# EAGLE design Orone-mini-S8C-v0r001 (EAGLE 5.11)
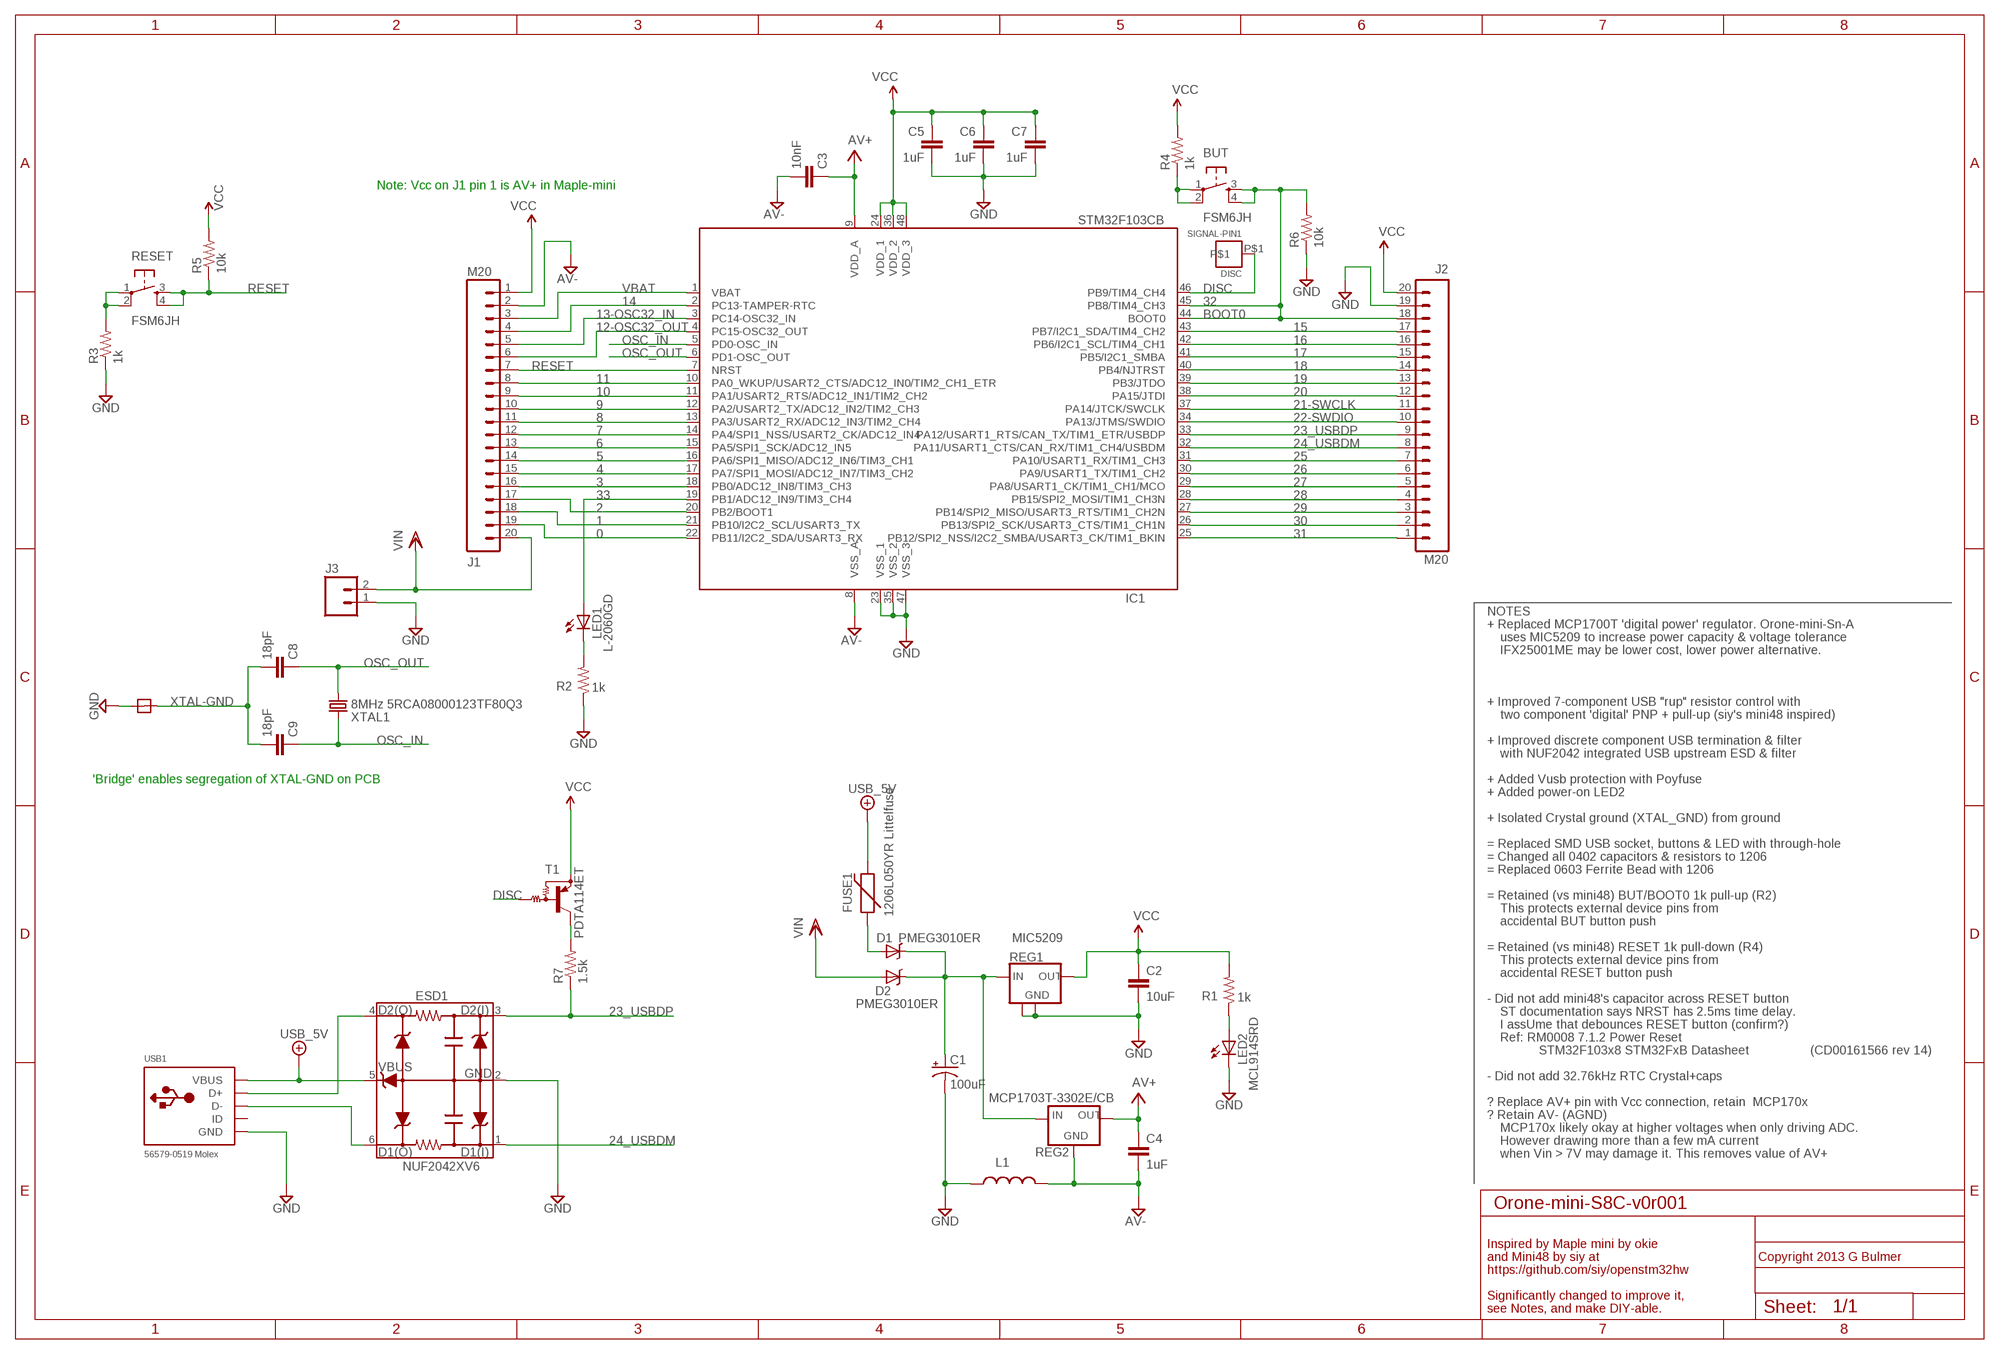
[diagram p0: schematic, sheet 1]

## Parts
BUT  FSM6JH  TAC_SWITCHPTH  [TACTILE-PTH]
C1  100uF  CAP_POL7343  [EIA7343]
C2  10uF  CAP1206  [1206]
C3  10nF  CAP1206  [1206]
C4  1uF  CAP1206  [1206]
C5  1uF  CAP1206  [1206]
C6  1uF  CAP1206  [1206]
C7  1uF  CAP1206  [1206]
C8  18pF  CAP1206  [1206]
C9  18pF  CAP1206  [1206]
D1  PMEG3010ER  DIODE-SCHOTTKYSOD-123W  [SOD-123W]
D2  PMEG3010ER  DIODE-SCHOTTKYSOD-123W  [SOD-123W]
DISC  SIGNAL-PIN1  [1PIN]
ESD1  NUF2042XV6  NUF2042XV6SOT563  [SOT563]
FUSE1  1206L050YR Littelfuse  PTCSMD  [PTC-1206]
IC1  STM32F103CB  [LQFP48]
J1  M20  [1X20]
J2  M20  [1X20]
J3  M02POLAR  [MOLEX-1X2]
L1  INDUCTOR1206  [1206]
LED1  L-2060GD  LED1.8MM-W  [LED1.8MM-W]
LED2  MCL914SRD  LED1.8MM-W  [LED1.8MM-W]
R1  1k  RESISTOR1206  [1206]
R2  1k  RESISTOR1206  [1206]
R3  1k  RESISTOR1206  [1206]
R4  1k  RESISTOR1206  [1206]
R5  10k  RESISTOR1206  [1206]
R6  10k  RESISTOR1206  [1206]
R7  1.5k  RESISTOR1206  [1206]
REG1  MIC5209  V_REG_LM2937SOT223-NT  [SOT223-NT]
REG2  MCP1703T-3302E/CB  MCP170XSOT23  [SOT23]
RESET  FSM6JH  TAC_SWITCHPTH  [TACTILE-PTH]
T1  PDTA114ET  ES_PNP-DRIVERSOT23-3  [ES_SOT23-3]
U$4  2PIN-GND-BRIDGE08X08MILS  [2PIN-08X08]
USB1  56579-0519 Molex  USB-MINIBTH-ODRILL  [USB-MINI-AB-TH-MOLEX-OVERDRILL]
XTAL1  8MHz 5RCA08000123TF80Q3  CRYSTAL5X3  [CRYSTAL-SMD-5X3]

## Nets
0: IC1.22(PB11/I2C2_SDA/USART3_RX) J1.19
1: IC1.21(PB10/I2C2_SCL/USART3_TX) J1.18
2: IC1.20(PB2/BOOT1) J1.17
3: IC1.18(PB0/ADC12_IN8/TIM3_CH3) J1.16
4: IC1.17(PA7/SPI1_MOSI/ADC12_IN7/TIM3_CH2) J1.15
5: IC1.16(PA6/SPI1_MISO/ADC12_IN6/TIM3_CH1) J1.14
6: IC1.15(PA5/SPI1_SCK/ADC12_IN5) J1.13
7: IC1.14(PA4/SPI1_NSS/USART2_CK/ADC12_IN4) J1.12
8: IC1.13(PA3/USART2_RX/ADC12_IN3/TIM2_CH4) J1.11
9: IC1.12(PA2/USART2_TX/ADC12_IN2/TIM2_CH3) J1.10
10: IC1.11(PA1/USART2_RTS/ADC12_IN1/TIM2_CH2) J1.9
11: IC1.10(PA0_WKUP/USART2_CTS/ADC12_IN0/TIM2_CH1_ETR) J1.8
12-OSC32_OUT: IC1.4(PC15-OSC32_OUT) J1.6
13-OSC32_IN: IC1.3(PC14-OSC32_IN) J1.5
14: IC1.2(PC13-TAMPER-RTC) J1.4
15: IC1.43(PB7/I2C1_SDA/TIM4_CH2) J2.17
16: IC1.42(PB6/I2C1_SCL/TIM4_CH1) J2.16
17: IC1.41(PB5/I2C1_SMBA) J2.15
18: IC1.40(PB4/NJTRST) J2.14
19: IC1.39(PB3/JTDO) J2.13
20: IC1.38(PA15/JTDI) J2.12
21-SWCLK: IC1.37(PA14/JTCK/SWCLK) J2.11
22-SWDIO: IC1.34(PA13/JTMS/SWDIO) J2.10
23_USBDP: ESD1.3(D2(I)) IC1.33(PA12/USART1_RTS/CAN_TX/TIM1_ETR/USBDP) J2.9 R7.1
24_USBDM: ESD1.1(D1(I)) IC1.32(PA11/USART1_CTS/CAN_RX/TIM1_CH4/USBDM) J2.8
25: IC1.31(PA10/USART1_RX/TIM1_CH3) J2.7
26: IC1.30(PA9/USART1_TX/TIM1_CH2) J2.6
27: IC1.29(PA8/USART1_CK/TIM1_CH1/MCO) J2.5
28: IC1.28(PB15/SPI2_MOSI/TIM1_CH3N) J2.4
29: IC1.27(PB14/SPI2_MISO/USART3_RTS/TIM1_CH2N) J2.3
30: IC1.26(PB13/SPI2_SCK/USART3_CTS/TIM1_CH1N) J2.2
31: IC1.25(PB12/SPI2_NSS/I2C2_SMBA/USART3_CK/TIM1_BKIN) J2.1
32: BUT.3 BUT.4 IC1.44(BOOT0) IC1.45(PB8/TIM4_CH3) J2.18 R6.2
33: IC1.19(PB1/ADC12_IN9/TIM3_CH4) LED1.A
+5V/2: ESD1.5(VBUS) FUSE1.2 USB1.VBUS ; supply symbol labelled USB_5V
AV+: C3.1 C4.1 IC1.9(VDD_A) REG2.2(OUT)
AV-: C3.2 C4.2 IC1.8(VSS_A) J1.2 L1.2 REG2.1(GND)
DGND: C1.C(-) C2.2 C5.2 C6.2 C7.2 ESD1.2(GND) IC1.23(VSS_1) IC1.35(VSS_2) IC1.47(VSS_3) J2.19 J3.1 L1.1 LED2.C R2.1 R3.1 R6.1 REG1.2(GND) REG1.4(GND) U$4.P$1 USB1.GND ; supply symbol labelled GND
DISC: DISC.P$1 IC1.46(PB9/TIM4_CH4) T1.1(B)
N$1: BUT.1 BUT.2 R4.1
N$2: LED1.C R2.2
N$3: D1.P$2.ANODE(A) FUSE1.1
N$4: R3.2 RESET.1 RESET.2
N$5: C1.A(+) D1.P$1.CATHODE(C) D2.P$1.CATHODE(C) REG1.1(IN) REG2.3(IN)
N$6: LED2.A R1.1
N$51: R7.2 T1.3(C)
N$59: ESD1.4(D2(O)) USB1.D+
N$60: ESD1.6(D1(O)) USB1.D-
OSC_IN: C9.1 IC1.5(PD0-OSC_IN) XTAL1.3
OSC_OUT: C8.1 IC1.6(PD1-OSC_OUT) XTAL1.1
RESET: IC1.7(NRST) J1.7 R5.1 RESET.3 RESET.4
VBAT: IC1.1(VBAT) J1.3
VCC: C2.1 C5.1 C6.1 C7.1 IC1.24(VDD_1) IC1.36(VDD_2) IC1.48(VDD_3) J1.1 J2.20 R1.2 R4.2 R5.2 REG1.3(OUT) T1.2(E)
VIN: D2.P$2.ANODE(A) J1.20 J3.2
XTAL-GND: C8.2 C9.2 U$4.P$2
Unconnected: USB1.ID

## Notes on the sheet
- Note: Vcc on J1 pin 1 is AV+ in Maple-mini
- BOOT0
- NOTES
- + Replaced MCP1700T 'digital power' regulator. Orone-mini-Sn-A
- uses MIC5209 to increase power capacity & voltage tolerance
- IFX25001ME may be lower cost, lower power alternative.
- + Improved 7-component USB "rup" resistor control with
- two component 'digital' PNP + pull-up (siy's mini48 inspired)
- + Improved discrete component USB termination & filter
- with NUF2042 integrated USB upstream ESD & filter
- 'Bridge' enables segregation of XTAL-GND on PCB | + Added Vusb protection with Poyfuse
- + Added power-on LED2
- + Isolated Crystal ground (XTAL_GND) from ground
- = Replaced SMD USB socket, buttons & LED with through-hole
- = Changed all 0402 capacitors & resistors to 1206
- = Replaced 0603 Ferrite Bead with 1206
- = Retained (vs mini48) BUT/BOOT0 1k pull-up (R2)
- This protects external device pins from
- accidental BUT button push
- = Retained (vs mini48) RESET 1k pull-down (R4)
- This protects external device pins from
- accidental RESET button push
- - Did not add mini48's capacitor across RESET button
- ST documentation says NRST has 2.5ms time delay.
- I assUme that debounces RESET button (confirm?)
- Ref: RM0008 7.1.2 Power Reset
- STM32F103x8 STM32FxB Datasheet | (CD00161566 rev 14)
- - Did not add 32.76kHz RTC Crystal+caps
- ? Replace AV+ pin with Vcc connection, retain  MCP170x
- ? Retain AV- (AGND)
- MCP170x likely okay at higher voltages when only driving ADC.
- However drawing more than a few mA current
- when Vin > 7V may damage it. This removes value of AV+
- Inspired by Maple mini by okie
- and Mini48 by siy at | Copyright 2013 G Bulmer
- https://github.com/siy/openstm32hw
- Significantly changed to improve it,
- see Notes, and make DIY-able.

## Library data of the parts
BUT RESET = SparkFun:TAC_SWITCH: Momentary Switch Button commonly used for reset or general input. Spark Fun Electronics SKU : COM-00097
C1 = smd-poly-cap:CAP_POL: Capacitor Polarized These are standard SMD and PTH capacitors. Normally 10uF, 47uF, and 100uF in electrolytic and tantalum varieties. Always verify the external diameter of the through hole cap, it varies with capacity, voltage, and manufacturer. The EIA devices should be standard.
C2-C9 = SMD-passives-gb01:CAP: Capacitor Standard 1206 SMD ceramic capacitor
D1 D2 = diode-schottky:DIODE-SCHOTTKY
DISC = signal-pins:SIGNAL-PIN1
ESD1 = USB-ESD-protection:NUF2042XV6: NUF2042XV6 - USB ESD protection, and Full-speed USB termination. Resistor values are 22ohm. Capacitor values are 42pF.
FUSE1 = SparkFun:PTC: Resettable Fuse PTC Resettable Fuse. Spark Fun Electronics SKU : COM-08357
IC1 = stm32:STM32F103CB
J1 J2 = SparkFun:M20: 20 pin Header Contains both standard and LOCK variants. The lock_special holes are staggared by 5 mil, like the lock variant, except for the last two holes. They are not altered from the "standard" footprint layout. This is used for a special purpose on the layout of our Graphic LCD Backpack. Make sure you want to use this device before selecting it for you project!
J3 = SparkFun:M02: Header 2 Standard 2-pin 0.1" header. Use with straight break away headers (SKU : PRT-00116), right angle break away headers (PRT-00553), swiss pins (PRT-00743), machine pins (PRT-00117), and female headers (PRT-00115). Molex polarized connector foot print use with SKU : PRT-08233 with associated crimp pins and housings.
L1 = SMD-passives-gb01:INDUCTOR: Inductors This is Sparkfun's Inductor, using the standard resistor/capacitor footprint. It has not been proven. The 1206 footprint also matches the Ferrite Bead footprint for fair-rite at fair-rite.com was http://www.fair-rite.com/cgibin/catalog.pgm?THEAPPL=Suppression+Components&THEWHERE=Board+Component&THEPART=Chip+Beads#select:freq1
LED1 LED2 = LED:LED: LEDs Standard schematic elements and footprints for 5mm, 3mm, 1206, and 0603 sized LEDs. 5mm - Spark Fun Electronics SKU : COM-00529 (and others)
R1-R7 = SMD-passives-gb01:RESISTOR: Resistor Basic schematic elements and footprints for 0603, 1206, and PTH resistors.
REG1 = V_REG_LM2937:V_REG_LM2937: LM2937-footprint LDO Voltage regulator LM2937 500mA minimum 4.75V in 3.3V out: http://www.ti.com/product/lm2937-3.3 or http://www.ti.com/product/lm2937 MIC5209 500mA, 600mV@0.5A dropout voltage (max): http://www.micrel.com/_PDF/mic5209.pdf MIC39100 1A, 630mV@1A dropout voltage (max): http://www.micrel.com/_PDF/mic39100.pdf
REG2 = MCP170x:MCP170X: Microchip MCP170x voltage regulator MCP1702 http://ww1.microchip.com/downloads/en/DeviceDoc/22008E.pdf MCP1703 http://ww1.microchip.com/downloads/en/DeviceDoc/22049f.pdf
T1 = pnp_digital_transistor:ES_PNP-DRIVER
U$4 = senzate-2010-02:2PIN-GND-BRIDGE
USB1 = USB-Mini-Molex:USB-MINIB: USB Connectors USBMINIB Thru-hole Mini-AB Molex RA TH-SLOT is Molex part # 56579-0576 (gbulmer) - Untested Thru-hole Mini-AB Molex RA TH-DRILL is Molex part # 56579-0576 **CHECK WITH PCB Maker close-drilling of holes is okay (gbulmer) - Untested Thru-hole Mini-B RA MULTICOMP-TH is a Multicomp MC32599 from Farnell.com (gbulmer) - Untested
XTAL1 = SparkFun2:CRYSTAL: Crystals Various standard crystals. Proven footprints. Spark Fun Electronics SKU : COM-00534

## Net classes
1 vcc: width 0.254 mm

## Board
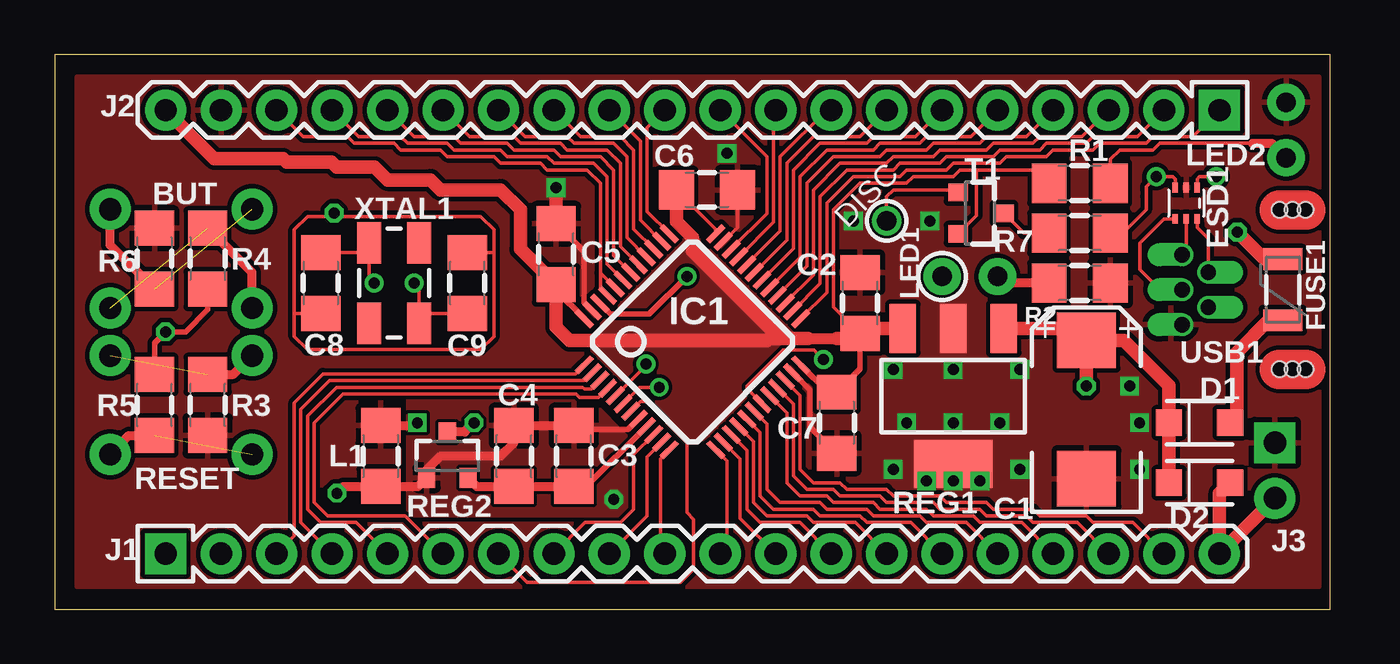
[diagram p1: board, top side]
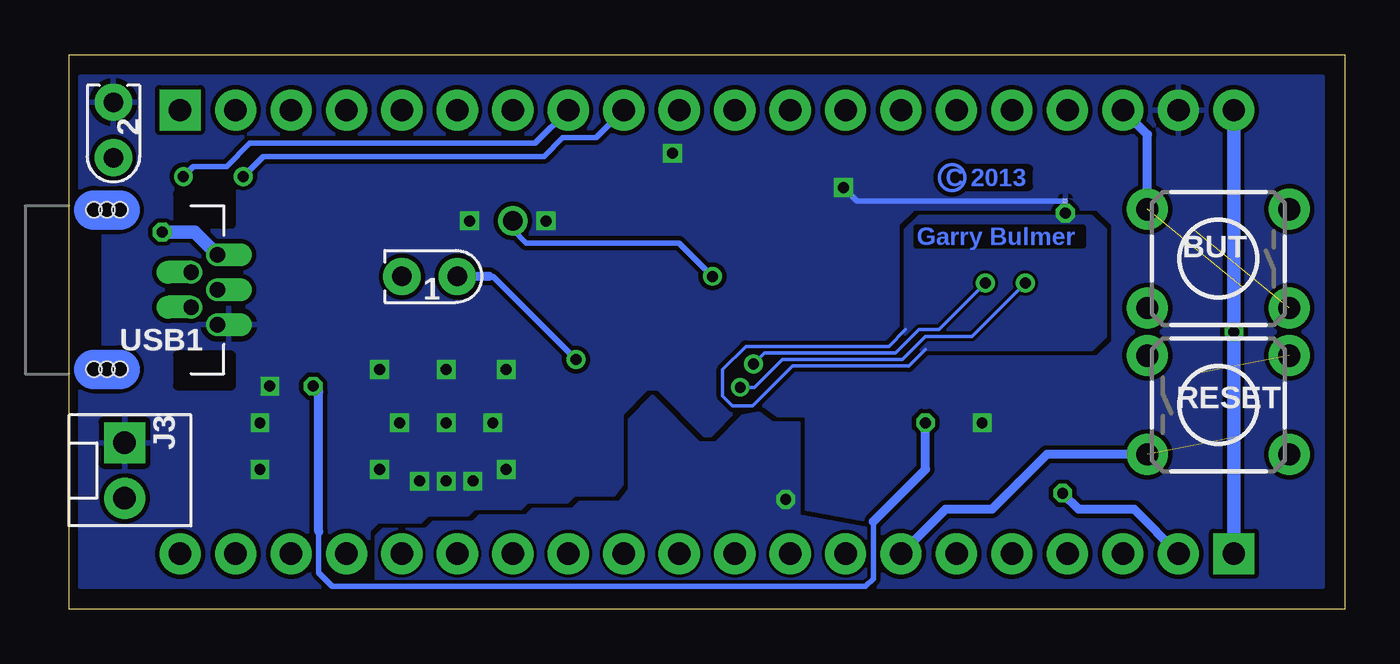
[diagram p2: board, bottom side, seen from below]

Size 58.42 x 25.4 mm. Coordinates in mm from the lower left corner, seen from the top.
Outline: 0,0 58.42,0 58.42,25.4 0,25.4 0,0
Copper layers (1*16): Top 0.0356mm / dielectric 1.5011mm / Bottom 0.0356mm
Design rules "LaenPCBOrder *": minimum track width 6mil, minimum drill 13mil, track to track 6mil, track to pad 6mil, pad to pad 6mil, via to via 6mil, smd to smd 6mil, copper to edge 15mil, drill to drill 6mil, minimum pad ring 7mil, minimum via ring 7mil, stop-mask expansion 4mil, vias tented up to drill 30mil, thermal gap 10mil
tRestrict: 1 lines

### Footprints (pad centres in the part's own frame; a part is rotated, then mirrored left to right if it is on the bottom)
TACTILE-PTH = drill 1.016 pad 1.88 round: 1 -3.251,2.261; 2 3.251,2.261; 3 -3.251,-2.261; 4 3.251,-2.261
EIA7343 = smd 2.55 x 2.7: A 3.17,0; C -3.17,0
1206 = smd 1.6 x 1.8: 1 -1.4,0; 2 1.4,0
SOD-123W = smd 1.2 x 1.2: P$1.CATHODE -1.4,0; P$2.ANODE 1.4,0
1PIN = drill 0.9 round: P$1 0,0
SOT563 = smd 0.25 x 0.45: 1 -0.5,-0.72; 2 0,-0.72; 3 0.5,-0.72; 4 0.5,0.72; 6 -0.5,0.72 | smd 0.25 x 0.44: 5 0,0.72
PTC-1206 = smd 1 x 1.8: 1 -1.4,0; 2 1.4,0
LQFP48@1 = smd 0.254 x 1: 1 -2.75,-4.25; 2 -2.25,-4.25; 3 -1.75,-4.25; 4 -1.25,-4.25; 5 -0.75,-4.25; 6 -0.25,-4.25; 7 0.25,-4.25; 8 0.75,-4.25; 9 1.25,-4.25; 10 1.75,-4.25; 11 2.25,-4.25; 12 2.75,-4.25; 25 2.75,4.25; 26 2.25,4.25; 27 1.75,4.25; 28 1.25,4.25; 29 0.75,4.25; 30 0.25,4.25; 31 -0.25,4.25; 32 -0.75,4.25; 33 -1.25,4.25; 34 -1.75,4.25; 35 -2.25,4.25; 36 -2.75,4.25 | smd 1 x 0.254: 13 4.25,-2.75; 14 4.25,-2.25; 15 4.25,-1.75; 16 4.25,-1.25; 17 4.25,-0.75; 18 4.25,-0.25; 19 4.25,0.25; 20 4.25,0.75; 21 4.25,1.25; 22 4.25,1.75; 23 4.25,2.25; 24 4.25,2.75; 37 -4.25,2.75; 38 -4.25,2.25; 39 -4.25,1.75; 40 -4.25,1.25; 41 -4.25,0.75; 42 -4.25,0.25; 43 -4.25,-0.25; 44 -4.25,-0.75; 45 -4.25,-1.25; 46 -4.25,-1.75; 47 -4.25,-2.25; 48 -4.25,-2.75
1X20 = drill 1.016 pad 1.88 square: 1 0,0 | drill 1.016 pad 1.88 round: 2 2.54,0; 3 5.08,0; 4 7.62,0; 5 10.16,0; 6 12.7,0; 7 15.24,0; 8 17.78,0; 9 20.32,0; 10 22.86,0; 11 25.4,0; 12 27.94,0; 13 30.48,0; 14 33.02,0; 15 35.56,0; 16 38.1,0; 17 40.64,0; 18 43.18,0; 19 45.72,0; 20 48.26,0
MOLEX-1X2 = drill 1.016 pad 1.88 square: 1 0,0 | drill 1.016 pad 1.88 round: 2 2.54,0
LED1.8MM-W = drill 0.9 pad 1.7 round: A 0,1.27; C 0,-1.27
SOT223-NT = smd 1.219 x 2.235: 1 -2.311,-3.099; 2 0,-3.099; 3 2.311,-3.099 | smd 3.6 x 2.2: 4 0,3.099
SOT23 = smd 0.8 x 0.9: 1 -0.95,-1; 2 0.95,-1; 3 0,1.1
ES_SOT23-3 = smd 0.8 x 0.9: 1 -0.95,-1; 2 0.95,-1; 3 0,1.1
2PIN-08X08 = smd 0.203 x 0.203: P$1 -0.102,0; P$2 0.102,0
USB-MINI-AB-TH-MOLEX-OVERDRILL = drill 0.7 offset: D+ 1.2,0; D- 0,0.8; GND 1.2,-1.6; ID 0,-0.8; VBUS 1.2,1.6 | hole 0.7: -4.45,3.65; -3.25,3.65; -4.45,-3.65; -3.25,-3.65; -3.85,3.65; -3.85,-3.65
CRYSTAL-SMD-5X3 = smd 1.9 x 1.1: 1 -1.85,-1.15; 2 1.85,-1.15; 3 1.85,1.15; 4 -1.85,1.15

### Placement (x,y rotation side)
BUT  5.79,16.05 180 bottom
C1  47.24,9.14 90 top
C2  36.88,14.02 90 top
C3  23.77,7.01 90 top
C4  21.03,7.01 90 top
C5  22.96,16.26 90 top
C6  29.87,19.2 0 top
C7  35.81,8.53 270 top
C8  12.19,14.94 270 top
C9  18.9,14.94 90 top
D1  52.43,8.53 0 top
D2  52.43,5.79 0 top
DISC  38.1,17.78 0 top
ESD1  51.82,18.59 180 top
FUSE1  56.24,14.63 90 top
IC1  STM32F103CB  [LQFP48@1]  29.21,12.24 315 top
J1  5.08,2.54 0 top
J2  53.34,22.86 180 top
J3  55.88,7.62 270 bottom
L1  14.94,7.01 270 top
LED1  41.91,15.24 270 bottom
LED2  56.39,21.95 180 bottom
R1  46.94,19.51 180 top
R2  46.94,14.94 180 top
R3  7.01,9.35 90 top
R4  7.01,16.05 270 top
R5  4.57,9.35 90 top
R6  4.57,16.05 270 top
R7  46.94,17.22 180 top
REG1  41.15,9.75 180 top
REG2  17.98,7.01 0 top
RESET  5.79,9.35 0 bottom
T1  42.37,18.14 270 top
U$4  12.8,18.59 270 bottom
USB1  52.83,14.63 0 bottom
XTAL1  15.54,14.94 270 top

### Tracks (layer width: path | path; a pad name or v marks a point on that pad's centre or on a via)
0
  Top 0.152: IC1.22 34.14,9.79 34.14,6.4 34.75,5.79 35.97,5.79 36.27,5.49 38.1,5.49 38.41,5.18 40.54,5.18 40.84,4.88 42.67,4.88 42.98,4.57 44.81,4.57 45.11,4.27 47.24,4.27 47.55,3.96 49.38,3.96 J1.19
1
  Top 0.152: IC1.21 33.83,9.39 33.83,6.1 34.44,5.49 35.66,5.49 35.97,5.18 37.8,5.18 38.1,4.88 40.23,4.88 40.54,4.57 42.37,4.57 42.67,4.27 44.5,4.27 44.81,3.96 46.84,3.96 J1.18
2
  Top 0.152: IC1.20 33.53,8.98 33.53,5.79 34.14,5.18 35.36,5.18 35.66,4.88 37.49,4.88 37.8,4.57 39.93,4.57 40.23,4.27 42.06,4.27 42.37,3.96 44.3,3.96 J1.17
3
  Top 0.152: IC1.18 32.61,8.49 32.61,5.49 33.22,4.88 35.05,4.88 35.36,4.57 37.19,4.57 37.49,4.27 39.62,4.27 39.93,3.96 41.76,3.96 J1.16
4
  Top 0.152: IC1.17 32.31,8.08 32.31,5.18 32.92,4.57 34.75,4.57 35.05,4.27 36.88,4.27 37.19,3.96 39.22,3.96 J1.15
5
  Top 0.152: IC1.16 32,7.68 32,4.88 32.61,4.27 34.44,4.27 34.75,3.96 36.68,3.96 J1.14
6
  Top 0.152: IC1.15 31.7,7.28 31.7,4.57 32.31,3.96 34.14,3.96 J1.13
7
  Top 0.152: IC1.14 31.39,6.88 31.39,4.17 J1.12
8
  Top 0.152: IC1.13 30.79,6.78 30.79,2.85 J1.11
9
  Top 0.152: IC1.12 27.74,6.88 27.74,2.74 J1.10
10
  Top 0.152: IC1.11 27.13,6.98 27.13,4.27 J1.9
11
  Top 0.152: IC1.10 26.52,7.08 26.52,4.57 25.91,3.96 24.28,3.96 J1.8
12-OSC32_OUT
  Top 0.152: IC1.4 24.9,9.7 24.03,9.7 23.88,9.86 13.21,9.86 11.89,8.53 11.89,4.88 12.5,4.27 16.05,4.27 J1.6
13-OSC32_IN
  Top 0.152: IC1.3 24.58,10.08 24.26,10.08 24.18,10.16 12.9,10.16 11.58,8.84 11.58,4.57 12.19,3.96 13.82,3.96 J1.5
14
  Top 0.152: IC1.2 24.25,10.46 12.6,10.46 11.28,9.14 11.28,3.96 J1.4
15
  Top 0.152: IC1.43 25.3,15.8 25.3,19.81 24.69,20.42 22.86,20.42 22.55,20.73 20.73,20.73 20.42,21.03 18.29,21.03 17.98,21.34 16.15,21.34 15.85,21.64 13.92,21.64 J2.17
16
  Top 0.152: IC1.42 25.6,16.2 25.6,20.12 24.99,20.73 23.16,20.73 22.86,21.03 21.03,21.03 20.73,21.34 18.59,21.34 18.29,21.64 16.46,21.64 J2.16
17
  Top 0.152: IC1.41 25.91,16.61 25.91,20.42 25.3,21.03 23.47,21.03 23.16,21.34 21.34,21.34 21.03,21.64 19,21.64 J2.15
18
  Top 0.152: IC1.40 26.21,17.01 26.21,20.73 25.6,21.34 23.77,21.34 23.47,21.64 21.54,21.64 J2.14
19
  Top 0.152: IC1.39 26.52,17.41 26.52,21.03 25.91,21.64 24.08,21.64 J2.13
20
  Top 0.152: IC1.38 26.82,17.81 26.82,21.44 J2.12
21-SWCLK
  Top 0.152: IC1.37 27.13,18.21 27.13,22.05 J2.11
22-SWDIO
  Top 0.152: IC1.34 32.61,18.12 32.61,20.73 J2.10
23_USBDP  (via drill 0.5)
  Top 0.152: IC1.33 32.92,17.72 32.92,22.76 J2.9 | R7.1 48.92,17.22 49.99,18.29 49.99,18.9 49.99,19.2 49.99,19.36 v50.44,19.81 51.21,19.81 51.32,19.7 ESD1.3
  Bottom 0.254: J2.9 34.29,21.59 35.81,21.59 36.68,20.73 49.53,20.73 v50.44,19.81
24_USBDM  (via drill 0.5)
  Top 0.152: IC1.32 33.22,17.32 33.22,20.73 35.36,22.86 J2.8 | ESD1.1 52.32,19.7 52.43,19.81 v53.19,19.81
  Bottom 0.254: J2.8 37.08,21.34 50.14,21.34 51.21,20.27 52.73,20.27 v53.19,19.81
25
  Top 0.152: IC1.31 33.53,16.91 33.53,20.42 34.75,21.64 36.88,21.64 J2.7
26
  Top 0.152: IC1.30 33.83,16.51 33.83,20.12 35.05,21.34 37.19,21.34 37.49,21.64 39.42,21.64 J2.6
27
  Top 0.152: IC1.29 34.14,16.11 34.14,19.81 35.36,21.03 37.49,21.03 37.8,21.34 39.62,21.34 39.93,21.64 41.96,21.64 J2.5
28
  Top 0.152: IC1.28 34.44,15.71 34.44,19.51 35.66,20.73 37.8,20.73 38.1,21.03 39.93,21.03 40.23,21.34 42.37,21.34 42.67,21.64 44.5,21.64 J2.4
29
  Top 0.152: IC1.27 34.75,15.3 34.75,19.2 35.97,20.42 38.1,20.42 38.41,20.73 40.23,20.73 40.54,21.03 42.67,21.03 42.98,21.34 44.81,21.34 45.11,21.64 47.04,21.64 J2.3
30
  Top 0.152: IC1.26 35.05,14.9 35.05,18.9 36.27,20.12 38.41,20.12 38.71,20.42 40.54,20.42 40.84,20.73 42.98,20.73 43.28,21.03 45.11,21.03 45.41,21.34 47.24,21.34 47.55,21.64 49.58,21.64 J2.2
31
  Top 0.152: IC1.25 35.36,14.5 35.36,18.59 36.58,19.81 38.71,19.81 39.01,20.12 40.84,20.12 41.15,20.42 43.28,20.42 43.59,20.73 45.41,20.73 45.72,21.03 47.55,21.03 47.85,21.34 49.99,21.34 50.29,21.64 52.12,21.64 J2.1
32  (1 unrouted)
  Top 0.152: 24.99,15.4 IC1.44 | 24.99,15.4 24.99,19.51 24.38,20.12 22.55,20.12 22.25,20.42 20.42,20.42 20.12,20.73 17.98,20.73 17.68,21.03 15.85,21.03 15.54,21.34 13.72,21.34 13.41,21.64 11.38,21.64 J2.18 | IC1.45 24.99,14.69 24.99,15.4
  Top 0.406: BUT.3 2.54,16.68 R6.2
  Bottom 0.406: J2.18 9.04,21.74 BUT.4
33  (via drill 0.5)
  Top 0.152: IC1.19 31.7,10.11 31.7,10.21 33.35,11.86 34.77,11.86 v35.2,11.43
  Bottom 0.254: v35.2,11.43 39.01,15.24 39.17,15.24
  Bottom 0.406: 39.17,15.24 LED1.A
+5V/2  (via drill 0.5)
  Top 0.152: ESD1.5 51.82,16.41 USB1.VBUS
  Top 0.61: v54.15,17.27 55.39,16.03 FUSE1.2
  Bottom 0.61: v54.15,17.27 52.67,17.27 USB1.VBUS
AV+
  Top 0.254: IC1.9 24.34,5.61 C3.1
  Top 0.406: C3.1 C4.1 19.33,5.61 REG2.2
AV-  (via drill 0.5)
  Top 0.254: IC1.8 26.26,8.23 23.95,8.23 C3.2
  Top 0.406: C3.2 C4.2 21.03,7.62 20.42,7.01 17.68,7.01 17.03,6.37 REG2.1 16.63,5.61 L1.2 13.23,5.61 v12.93,5.31
  Bottom 0.406: v12.93,5.31 12.19,4.57 9.65,4.57 J1.2
  other vias: 25.6,5.03
  pour Top: 16.15,9.75 24.38,9.75 26.52,7.62 26.52,4.27 16.15,4.27
  pour Bottom: 31.7,9.75 32.77,8.69 32.77,5.49 33.22,4.88 35.05,4.88 35.36,4.57 37.19,4.57 37.49,4.27 39.62,4.27 39.93,3.96 41.76,3.96 42.06,3.66 44.04,3.66 44.35,3.35 44.35,1.37 21.64,1.07 21.64,3.66 24.99,4.27 24.99,8.53 26.21,8.53 26.82,8.99 27.58,8.84 28.8,7.62 29.57,7.62
DGND  (via drill 0.5)
  Top 0.152: IC1.35 31.27,17.48 C6.2
  Top 0.254: IC1.47 24.23,14.04 24.23,16.39 C5.2 | IC1.23 34.59,10.04 34.59,8.35 C7.2
  Top 0.406: L1.1 16.49,8.41 v16.61,8.53
  Top 0.61: v22.96,19.3 C5.2
  Bottom 0.254: U$4.P$1 22.35,18.69 v22.96,19.3
  other vias: 30.78,20.88 38.4,6.4 44.2,6.4 38.4,10.97 39.01,8.53 41.15,8.53 43.28,8.53 44.2,10.97 41.15,10.97 41.15,5.87 49.68,8.53 49.23,10.21 40.08,17.78 49.68,6.4 42.37,5.87 39.93,5.87 36.58,17.78
  pour Bottom (isolate 0.203, rank 2): 1.02,1.02 57.91,1.02 57.91,24.38 1.02,24.38
  pour Top (isolate 0.203, rank 2): 1.02,1.02 57.91,1.02 57.91,24.38 1.02,24.38
DISC  (via drill 0.5)
  Top 0.152: T1.1 41.25,19.2 38.41,19.2 38.1,18.9 DISC.P$1
  Top 0.254: IC1.46 25.46,13.51 27.23,13.51 v28.96,15.24
  Bottom 0.254: v28.96,15.24 30.48,16.76 37.49,16.76 38.1,17.37 DISC.P$1
N$1  (1 unrouted)
  Top 0.406: BUT.2 9.04,15.42 R4.1
N$2
  Top 0.406: R2.2 43.48,14.94 LED1.C
N$3
  Top 0.61: D1.P$2.ANODE 54.13,8.84 54.13,11.76 55.6,13.23 FUSE1.1
N$4  (1 unrouted)
  Top 0.406: RESET.1 8.18,10.75 R3.2
N$5  (via drill 0.5)
  Top 0.406: REG2.3 18.78,8.11 v19.2,8.53
  Top 0.61: D2.P$1.CATHODE D1.P$1.CATHODE 51.03,10.24 48.95,12.31 C1.A | C1.A 46.71,12.85 REG1.1 | v47.24,10.21 C1.A
  Bottom 0.254: 21.59,4.01 21.59,1.4 21.95,1.04 46.38,1.04 46.99,1.65 46.99,3.56
  Bottom 0.406: v19.2,8.53 19.2,6.4 21.59,4.01 | 46.99,3.56 46.99,9.96 v47.24,10.21
N$6
  Top 0.152: R1.1 48.34,20.6 48.77,21.03 50.29,21.03 50.6,21.34 54.86,21.34
  Top 0.406: 54.86,21.34 55.73,21.34 LED2.A
N$51
  Top 0.152: T1.3 44.38,17.22 R7.2
N$59
  Top 0.152: USB1.D+ 50.6,14.63 49.68,15.54 49.68,16.76 50.79,17.87 ESD1.4
N$60
  Top 0.152: USB1.D- 52.83,16.97 52.32,17.48 ESD1.6
OSC_IN  (via drill 0.5)
  Top 0.152: IC1.5 27.08,11.17 v27.08,11.23 | v16.46,14.94 16.7,14.7 XTAL1.3 17.14,13.54 C9.1
  Bottom 0.152: v16.46,14.94 18.59,12.8 19.51,12.8 20.57,11.73 26.57,11.73 v27.08,11.23
OSC_OUT  (via drill 0.5)
  Top 0.152: IC1.6 26.77,10.16 v27.69,10.16 | v14.63,14.94 14.39,15.17 XTAL1.1 13.95,16.34 C8.1
  Bottom 0.152: v14.63,14.94 17.07,12.5 19.2,12.5 20.27,11.43 25.76,11.43 27.03,10.16 v27.69,10.16
RESET  (1 unrouted)
  Top 0.152: IC1.7 26.82,9.5 27.08,9.5 28.96,7.62 28.96,4.42 29.26,4.12 29.26,1.83 28.65,1.22 21.64,1.22 J1.7
  Top 0.406: R5.1 3.4,7.95 RESET.4
  Bottom 0.406: J1.7 18.29,4.57 16.15,4.57 13.64,7.09 RESET.3
VBAT
  Top 0.152: IC1.1 23.85,10.77 12.29,10.77 10.97,9.45 10.97,3.35 J1.3
VCC  (via drill 0.5)
  Top 0.152: J2.20 5.59,22.35 | IC1.36 30.27,17.4 C6.1 | 42.22,20.12 41.45,20.12 41.15,19.81 39.32,19.81 39.01,19.51 36.88,19.51 35.66,18.29 35.66,13.84 C2.1 | 42.22,20.12 44.93,20.12 R1.2 | T1.2 42.22,18.03 42.22,20.12
  Top 0.203: IC1.48 24.05,13.51
  Top 0.254: IC1.48 22.96,14.6 C5.1 | R5.2 4.57,12.19 v5.08,12.7 5.99,12.7 7.01,13.72 R4.2 | IC1.24 35.41,9.93 C7.1 36.88,11 C2.1
  Top 0.508: 34.44,12.39 34.49,12.39 35.81,12.39
  Top 0.61: J2.20 7.32,20.62 10.46,20.62 10.62,20.47 12.68,20.47 12.9,20.24 14.66,20.24 15.24,19.66 17.22,19.66 17.68,19.2 20.42,19.2 21.34,18.29 21.34,16.48 C5.1 22.96,12.92 23.59,12.29 32.61,12.29 32.72,12.39 33.22,12.39 | C6.1 28.47,17.76 29.21,17.02 29.21,16.41 33.22,12.39 | 33.22,12.39 34.49,12.39 | 35.81,12.39 36.66,12.39 C2.1 37.11,12.85 REG1.3
  Bottom 0.61: J1.1 v5.08,12.7 J2.20
  pour Top: 24.64,12.83 28.7,16.89 29.72,16.89 33.78,12.83 33.86,11.73 29.72,7.67 28.7,7.67 24.64,11.81
VIN
  Top 0.61: J3.2 J1.20 53.34,5.31 D2.P$2.ANODE
XTAL-GND  (via drill 0.5)
  Top 0.152: 10.97,13.54 10.97,12.5 11.58,11.89 19.51,11.89 20.12,12.5 20.12,16.34 | 10.97,13.54 C8.2 | 10.97,13.54 10.97,17.37 11.58,17.98 12.65,17.98 v12.8,18.14 12.95,17.98 19.51,17.98 20.12,17.37 20.12,16.34 | 20.12,16.34 C9.2
  Bottom 0.152: v12.8,18.14 U$4.P$2 | 19.2,11.89 19.96,11.12 25.3,11.12 27.13,9.3 28.04,9.3 28.5,9.75 28.5,10.97 27.43,12.04 20.88,12.04 20.12,12.8
  pour Bottom: 19.51,17.98 11.58,17.98 10.97,17.37 10.97,12.5 11.58,11.89 19.51,11.89 20.12,12.5 20.12,17.37
(copper drawn outside any net)
  shapes: Bottom circle x1

### Text on the board
Bottom: C 2013 | Garry Bulmer
tNames: BUT | USB1 | RESET | J3
bNames: 2 | 1
Document: Copyright 2013 G. Bulmer | 40pin 0.8" row spacing | This work is licensed under a | Creative Commons Attribution-ShareAlike 3.0 Unported License | I ask that my name remain visible in the copper | The pin headers are standard 'breadboard friendly' 0.1" pitch. | The two rows of pin headers are 0.8" apart, and hence fit a single breadboard. | The board is 2.3" long x 1" high. Most components are 1206 or larger. | Notes: | Change from 0805 to 1206 components is too much to fit in mini 2.1" length | Hence the board is lengthened from 2.1" to 2.3" | Replaced C1 with 7343-case size | Design Rules: OSHPark.com & Seeedstudio 'Fusion' PCB Service | Routing: | All Crystal tracks & Top Layer MCU tracks are 6mil/6mil | in order to make enough space for components and isolation. | All tracks from thru-hole (hand soldered) components, except pin headers, | are 10mil or wider. This is intended to make the tacks more robust. | All Bottom Layer tracks are 10mil or bigger, except Crystal tracks; | this is intended to be easier to make. | Copper pours have 10mil isolation; this is intended to be easier to make. | Vias: The three via shapes are used to give information, and help 'read' the PCB. | Vias Key: | SQUARE: Digital Ground (DGND) and thermal vias | ROUND: Signal | OCTAGON: Power (e.g. Vcc) or segregated Ground (e.g. AGND) | NOTE: There are four Hidden Airwires, which do not need routing (replicated on switches) | For safety, type 'RATSNEST *' to make them visible before making any changes
tDocu: Ground | Heatsink
_bsilk: but | 15 | 16 | 17 | 18 | 19 | 20 | 21 | 22 | 23 | 24 | 25 | 26 | 27 | 28 | 29 | 30 | 31 | 3.3V | Gnd | BUT | LED=33 | Gnd | RESET | boot1 | 3.3V | av- | Vbat | 14 | 13 | 12 | reset | 11 | 10 | 9 | 8 | 7 | 6 | 5 | 4 | 3 | 2 | 1 | 0 | Vin